# EAGLE schematic guava1_2_schematic_edit (EAGLE 7.7.0)
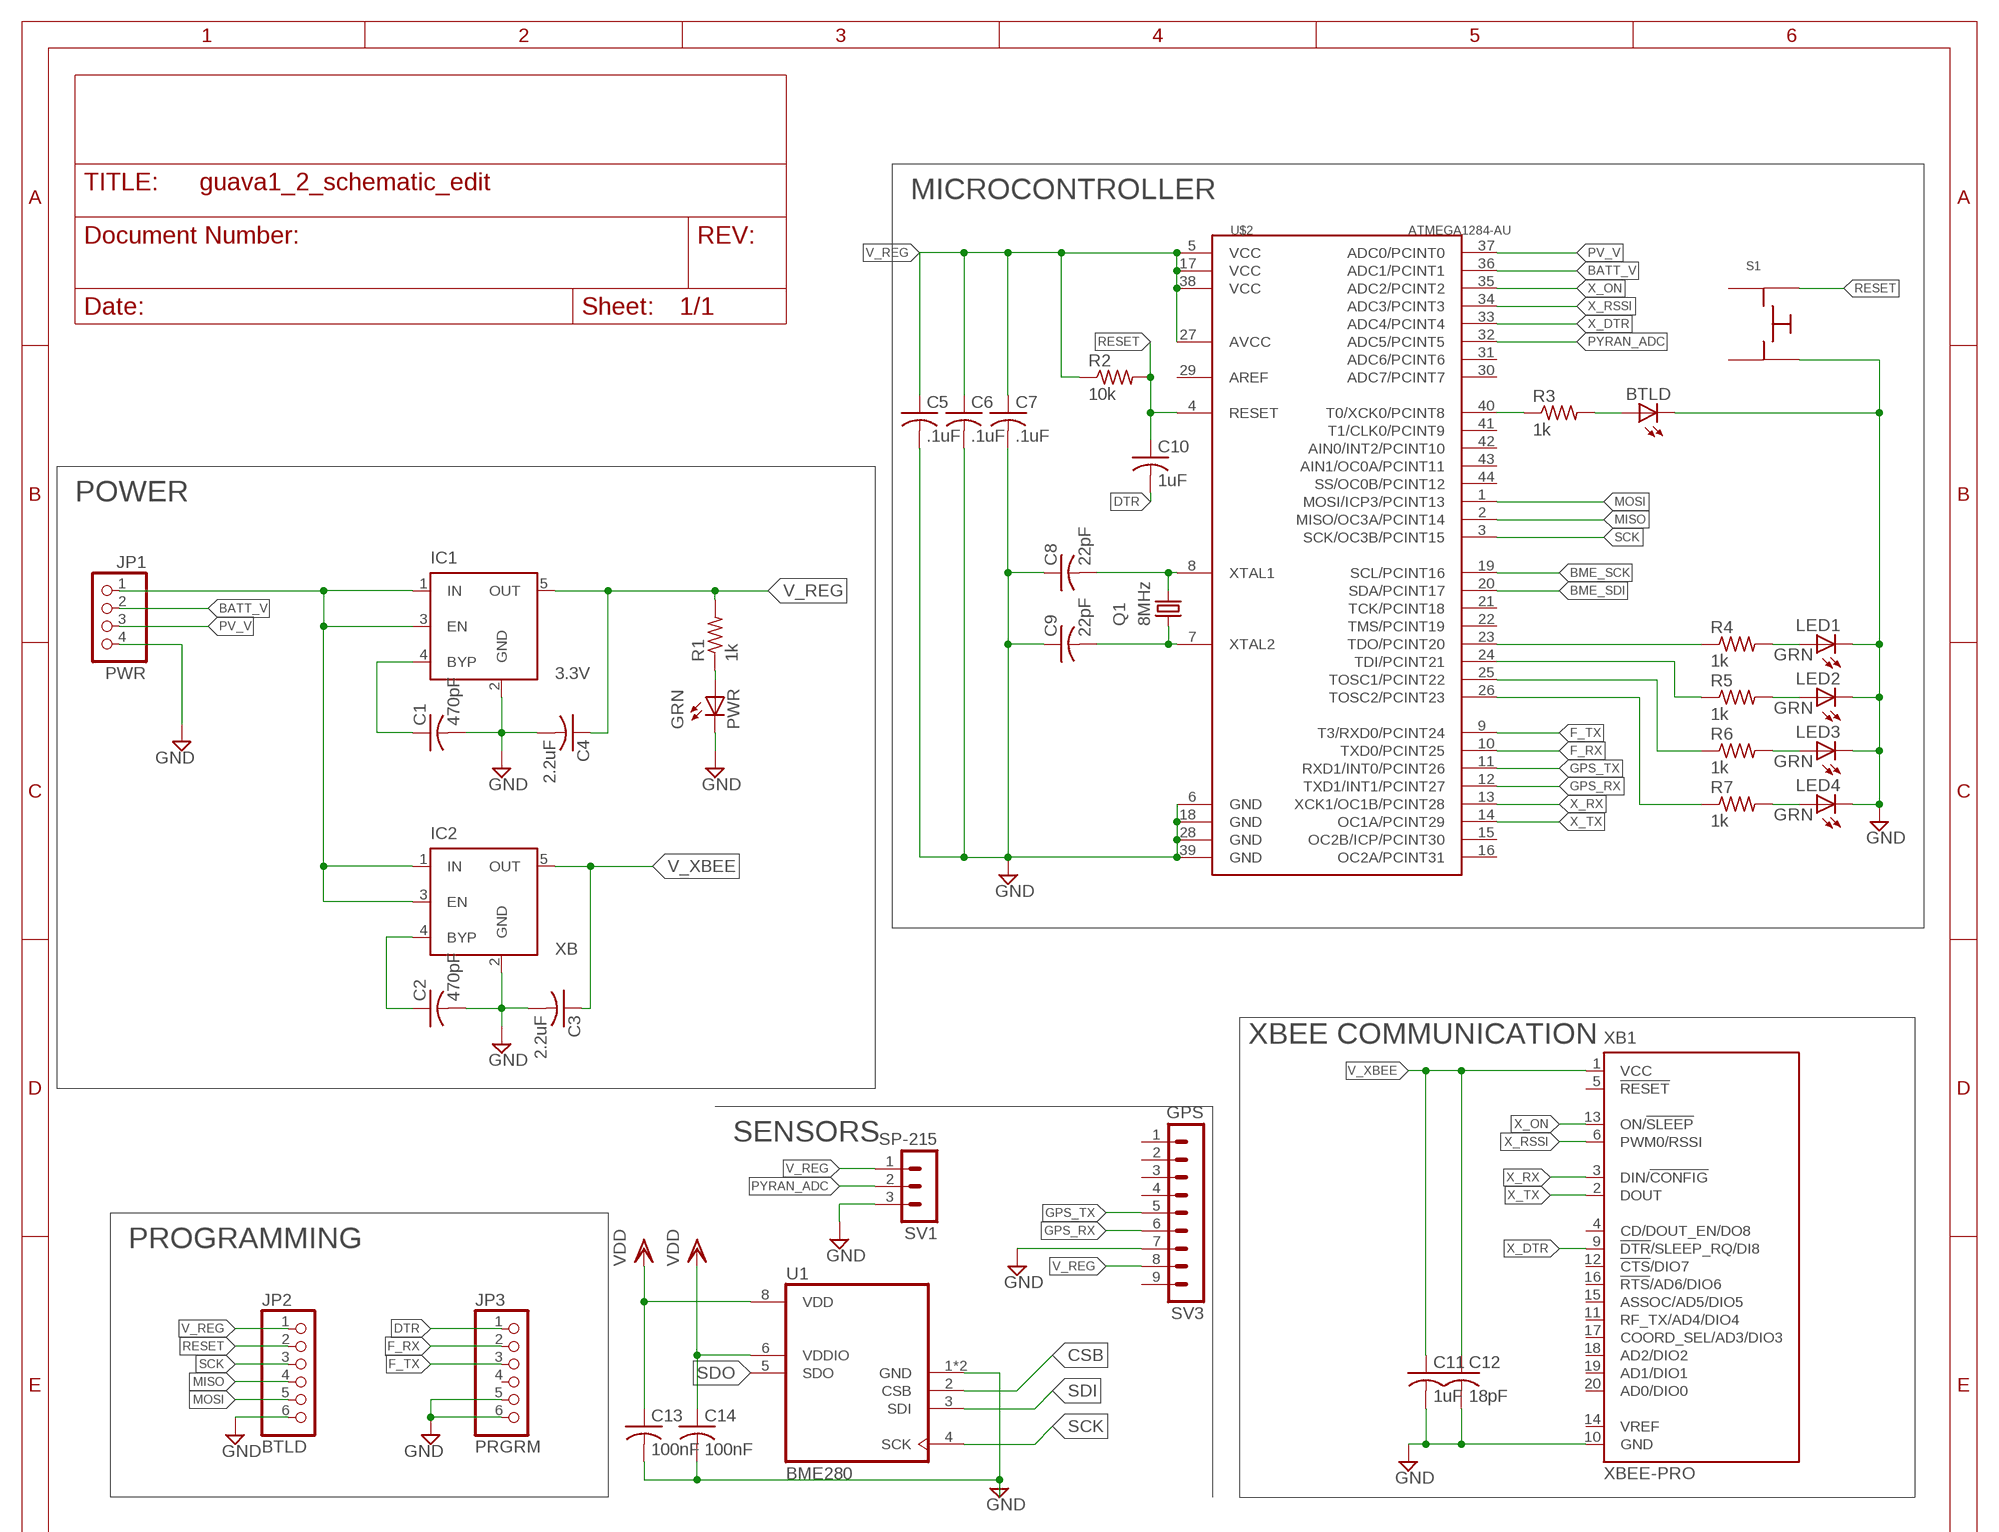
[diagram p0: schematic, sheet 1, part 1 of 2]
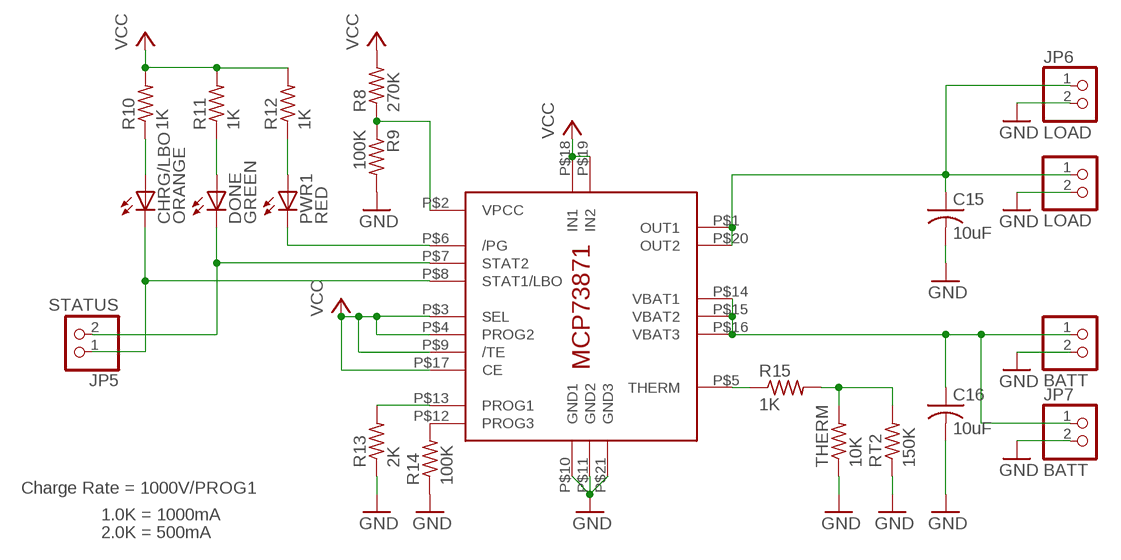
[diagram p1: schematic, sheet 1, part 2 of 2]

## Parts
BATT  JST_2PIN-SMT-RA  [JST-PH-2-SMT-RA]
BTLD  LEDCHIPLED_0805  [CHIPLED_0805]
C1  470pF  C-USC0402  [C0402]
C2  470pF  C-USC0402  [C0402]
C3  2.2uF  C-USC0603  [C0603]
C4  2.2uF  C-USC0603  [C0603]
C5  .1uF  C-USC0603  [C0603]
C6  .1uF  C-USC0603  [C0603]
C7  .1uF  C-USC0603  [C0603]
C8  22pF  C-USC0402  [C0402]
C9  22pF  C-USC0402  [C0402]
C10  1uF  C-USC0805  [C0805]
C11  1uF  C-USC0805  [C0805]
C12  18pF  C-USC0805  [C0805]
C13  100nF  C-US025-024X044  [C025-024X044]
C14  100nF  C-US025-024X044  [C025-024X044]
C15  10uF  C-USC0805K  [C0805K]
C16  10uF  C-USC0805K  [C0805K]
CHRG/LBO  ORANGE  LEDCHIP-LED0805  [CHIP-LED0805]
DONE  GREEN  LEDCHIP-LED0805  [CHIP-LED0805]
IC1  3.3V  MIC5219XX  [SOT23-5]
IC2  XB  MIC5219XX  [SOT23-5]
IC3  MCP73871  [QFN20_4MM]
JP1  PWR  PINHD-1X4  [1X04]
JP2  BTLD  PINHD-1X6  [1X06]
JP3  PRGRM  PINHD-1X6  [1X06]
JP5  STATUS  HEADER-1X2  [1X02_OVAL]
JP6  LOAD  HEADER-1X2  [1X02_OVAL]
JP7  BATT  HEADER-1X2  [1X02_OVAL]
LED1  GRN  LEDCHIPLED_0805  [CHIPLED_0805]
LED2  GRN  LEDCHIPLED_0805  [CHIPLED_0805]
LED3  GRN  LEDCHIPLED_0805  [CHIPLED_0805]
LED4  GRN  LEDCHIPLED_0805  [CHIPLED_0805]
LOAD  JST_2PIN-SMT-RA  [JST-PH-2-SMT-RA]
PWR  GRN  LEDCHIPLED_0805  [CHIPLED_0805]
PWR1  RED  LEDCHIP-LED0805  [CHIP-LED0805]
Q1  8MHz  CRYSTALHC49UP  [HC49UP]
R1  1k  R-US_R0603  [R0603]
R2  10k  R-US_R0603  [R0603]
R3  1k  R-US_R0603  [R0603]
R4  1k  R-US_R0603  [R0603]
R5  1k  R-US_R0603  [R0603]
R6  1k  R-US_R0603  [R0603]
R7  1k  R-US_R0603  [R0603]
R8  270K  R-US_R0805  [R0805]
R9  100K  R-US_R0805  [R0805]
R10  1K  R-US_R0805  [R0805]
R11  1K  R-US_R0805  [R0805]
R12  1K  R-US_R0805  [R0805]
R13  2K  R-US_FLIPFLOP  [0805-THM]
R14  100K  R-US_R0805  [R0805]
R15  1K  R-US_M0805  [M0805]
RT2  150K  R-US_M0805  [M0805]
S1  PUSH_BUTTON_SPSTSMD  [COM-12993]
SV1  SP-215  MA03-1  [MA03-1]
SV3  GPS  MA09-1  [MA09-1]
THERM  10K  R-US_FLIPFLOP  [0805-THM]
U1  BME280  [PSON65P250X250X100-8N]
U$2  ATMEGA1284-AU  [44A]
XB1  XBEE-PRO  [XBEE-PRO]

## Nets
BATT: BATT.1 C16.1 IC3.P$14(VBAT1) IC3.P$15(VBAT2) IC3.P$16(VBAT3) JP7.1
BATT_V: JP1.2 U$2.36(ADC1/PCINT1)
BME_SCK: U$2.19(SCL/PCINT16)
BME_SDI: U$2.20(SDA/PCINT17)
CSB: C13.2 C14.2 U1.1(GND) U1.2(CSB) U1.7(GND) ; supply symbol labelled GND
DTR: C10.2 JP3.1
F_RX: JP3.2 U$2.10(TXD0/PCINT25)
F_TX: JP3.3 U$2.9(T3/RXD0/PCINT24)
GND: BATT.2 BTLD.C C1.2 C2.2 C3.2 C4.2 C5.2 C6.2 C7.2 C8.1 C9.1 C11.2 C12.2 C15.2 C16.2 IC1.2(GND) IC2.2(GND) IC3.P$10(GND1) IC3.P$11(GND2) IC3.P$21(GND3) JP1.4 JP2.6 JP3.5 JP3.6 JP6.2 JP7.2 LED1.C LED2.C LED3.C LED4.C LOAD.2 PWR.C R9.2 R13.1 R14.1 RT2.1 S1.3 SV1.3 SV3.7 THERM.1 U$2.6(GND) U$2.18(GND) U$2.28(GND) U$2.39(GND) XB1.10(GND)
GPS_RX: SV3.6 U$2.12(TXD1/INT1/PCINT27)
GPS_TX: SV3.5 U$2.11(RXD1/INT0/PCINT26)
LED1: R4.1 U$2.23(TDO/PCINT20)
LED2: R5.1 U$2.24(TDI/PCINT21)
LED3: R6.1 U$2.25(TOSC1/PCINT22)
LED4: R7.1 U$2.26(TOSC2/PCINT23)
MISO: JP2.4 U$2.2(MISO/OC3A/PCINT14)
MOSI: JP2.5 U$2.1(MOSI/ICP3/PCINT13)
N$1: C8.2 Q1.2 U$2.8(XTAL1)
N$2: C9.2 Q1.1 U$2.7(XTAL2)
N$3: BTLD.A R3.2
N$4: R3.1 U$2.40(T0/XCK0/PCINT8)
N$5: IC3.P$2(VPCC) R8.1 R9.1
N$6: C1.1 IC1.4(BYP)
N$7: PWR.A R1.1
N$8: LED4.A R7.2
N$9: LED2.A R5.2
N$10: LED3.A R6.2
N$11: LED1.A R4.2
N$12: IC3.P$6(/PG) PWR1.C
N$13: DONE.C IC3.P$7(STAT2) JP5.2
N$14: C2.1 IC2.4(BYP)
N$15: CHRG/LBO.C IC3.P$8(STAT1/LBO) JP5.1
N$16: CHRG/LBO.A R10.1
N$17: DONE.A R11.1
N$18: PWR1.A R12.1
N$19: IC3.P$12(PROG3) R14.2
N$20: IC3.P$13(PROG1) R13.2
N$21: C15.1 IC3.P$1(OUT1) IC3.P$20(OUT2) JP6.1 LOAD.1
N$22: IC3.P$5(THERM) R15.1
N$23: R15.2 RT2.2 THERM.2
PV_V: JP1.3 U$2.37(ADC0/PCINT0)
PYRAN_ADC: SV1.2 U$2.32(ADC5/PCINT5)
RESET: C10.1 JP2.2 R2.2 S1.2 U$2.4(RESET)
SCK: JP2.3 U1.4(SCK) U$2.3(SCK/OC3B/PCINT15)
SDI: U1.3(SDI)
SDO: C14.1 U1.6(VDDIO) ; supply symbol labelled VDD
V_LOAD: IC1.1(IN) IC1.3(EN) IC2.1(IN) IC2.3(EN) JP1.1
V_REG: C4.1 C5.1 C6.1 C7.1 IC1.5(OUT) JP2.1 R1.2 R2.1 SV1.1 SV3.8 U$2.5(VCC) U$2.17(VCC) U$2.27(AVCC) U$2.38(VCC)
V_XBEE: C3.1 C11.1 C12.1 IC2.5(OUT) XB1.1(VCC)
VCC: IC3.P$3(SEL) IC3.P$4(PROG2) IC3.P$9(/TE) IC3.P$17(CE) IC3.P$18(IN1) IC3.P$19(IN2) R8.2 R10.2 R11.2 R12.2
VDD: C13.1 U1.8(VDD)
X_DTR: U$2.33(ADC4/PCINT4) XB1.9(!DTR!/SLEEP_RQ/DI8)
X_ON: U$2.35(ADC2/PCINT2) XB1.13(ON/!SLEEP)
X_RSSI: U$2.34(ADC3/PCINT3) XB1.6(PWM0/RSSI)
X_RX: U$2.13(XCK1/OC1B/PCINT28) XB1.3(DIN/!CONFIG)
X_TX: U$2.14(OC1A/PCINT29) XB1.2(DOUT)
Unconnected: JP3.4 S1.1 S1.4 SV3.1 SV3.2 SV3.3 SV3.4 SV3.9 U1.5(SDO) U$2.15(OC2B/ICP/PCINT30) U$2.16(OC2A/PCINT31) U$2.21(TCK/PCINT18) U$2.22(TMS/PCINT19) U$2.29(AREF) U$2.30(ADC7/PCINT7) U$2.31(ADC6/PCINT6) U$2.41(T1/CLK0/PCINT9) U$2.42(AIN0/INT2/PCINT10) U$2.43(AIN1/OC0A/PCINT11) U$2.44(SS/OC0B/PCINT12) XB1.4(CD/DOUT_EN/DO8) XB1.5(!RESET) XB1.11(RF_TX/AD4/DIO4) XB1.12(!CTS!/DIO7) XB1.14(VREF) XB1.15(ASSOC/AD5/DIO5) XB1.16(!RTS!/AD6/DIO6) XB1.17(COORD_SEL/AD3/DIO3) XB1.18(AD2/DIO2) XB1.19(AD1/DIO1) XB1.20(AD0/DIO0)

## Notes on the sheet
- MICROCONTROLLER
- POWER
- XBEE COMMUNICATION
- SENSORS | Charge Rate = 1000V/PROG1
- 1.0K = 1000mA
- 2.0K = 500mA
- PROGRAMMING

## Library data of the parts
BATT LOAD = adafruit:JST_2PIN: JST 2-Pin Connectors of various flavors SMT-RA (S2B-PH-SM4) 4UConnector #17311 SMT (B2B-PH-SM4) THM-RA (S2B-PH) THM (B2B-PH)
BTLD CHRG/LBO DONE LED1-LED4 PWR PWR1 = adafruit:LED: LED OSRAM: - CHIPLED LG R971, LG N971, LY N971, LG Q971, LY Q971, LO R971, LY R971 LH N974, LH R974 LS Q976, LO Q976, LY Q976 LO Q996 - Hyper CHIPLED LW Q18S LB Q993, LB Q99A, LB R99A - SideLED LS A670, LO A670, LY A670, LG A670, LP A670 LB A673, LV A673, LT A673, LW A673 LH A674 LY A675 LS A676, LA A676, LO A676, LY A676, LW A676 LS A679, LY A679, LG A679 - Hyper Micro SIDELED® LS Y876, LA Y876, LO Y876, LY Y876 LT Y87S - SmartLED LW L88C, LW L88S LB L89C, LB L89S, LG L890 LS L89K, LO L89K, LY L89K LS L896, LA L896, LO L896, LY L896 - TOPLED LS T670, LO T670, LY T670, LG T670, LP T670 LSG T670, LSP T670, LSY T670, LOP T670, LYG T670 LG T671, LOG T671, LSG T671 LB T673, LV T673, LT T673, LW T673 LH T674 LS T676, LA T676, LO T676, LY T676, LB T676, LH T676, LSB T676, LW T676 LB T67C, LV T67C, LT T67C, LS T67K, LO T67K, LY T67K, LW E67C LS E67B, LA E67B, LO E67B, LY E67B, LB E67C, LV E67C, LT E67C LW T67C LS T679, LY T679, LG T679 LS T770, LO T770, LY T770, LG T770, LP T770 LB T773, LV T773, LT T773, LW T773 LH T774 LS E675, LA E675, LY E675, LS T675 LS T776, LA T776, LO T776, LY T776, LB T776 LHGB T686 LT T68C, LB T68C - Hyper Mini TOPLED® LB M676 - Mini TOPLED Santana® LG M470 LS M47K, LO M47K, LY M47K Source: http://www.osram.convergy.de/
C1-C16 = adafruit:C-US: CAPACITOR, American symbol
IC1 IC2 = v-reg-micrel:MIC5219XX: VOLTAGE REGULATOR; OC_FARNELL: unknown; OC_NEWARK: unknown
IC3 = adafruit:MCP73871
JP1 = pinhead:PINHD-1X4: PIN HEADER
JP2 = pinhead:PINHD-1X6: PIN HEADER
JP3 = adafruit:PINHD-1X6: PIN HEADER
JP5-JP7 = microbuilder:HEADER-1X2: PIN HEADER
Q1 = adafruit:CRYSTAL: CRYSTAL; OC_FARNELL: unknown; OC_NEWARK: unknown
R1-R15 RT2 THERM = adafruit:R-US_: RESISTOR, American symbol
S1 = SCEL-SWITCHES:PUSH_BUTTON_SPST: COM-12993 - SMD 12mm square SPST button. This button is great for user input or a good reset button on a PCB. Specifications: Distributor: Sparkfun Distributor PN: COM-12993 <https://www.sparkfun.com/products/12993> Max Rating: 50mA @ 12V Supporting Materials COM-12993 Datasheet <https://cdn.sparkfun.com/datasheets/Components/Switches/N301102.pdf>
SV1 = con-lstb:MA03-1: PIN HEADER; OC_FARNELL: unknown; OC_NEWARK: unknown
SV3 = con-lstb:MA09-1: PIN HEADER; OC_FARNELL: unknown; OC_NEWARK: unknown
U1 = BME280:BME280: DIGITAL HUMIDITY, PRESSURE AND TEMPERATURE SENSOR * Digital interface I²C (up to 3.4 MHz) and SPI (3 and 4 wire, up to 10 MHz)* Supply voltage VDD main supply voltage range: 1.71 V to 3.6 V*VDDIO interface voltage range: 1.2 V to 3.6 V Operating range -40…+85 °C, 0…100 % rel. humidity, 300…1100 hPa The library has been designed by Richard Magdycz <https://www.facebook.com/groups/eaglecadsoftUK>; DESCRIPTION: Integrated pressure, humidity and temperature sensor; 8-pin 2.5x2.5x0.93mm LGA; MF: Bosch; MP: BME280; PACKAGE: LGA-8 Bosch
U$2 = atmega1284:ATMEGA1284-AU
XB1 = maxstream:XBEE: XBee (TM) /XBee-PRO(TM) OEM RF Modules Source: MaxStream, Inc. xbee_productmanual.pdf; MPN: XBP24-AWI-001; OC_FARNELL: 1337916; OC_NEWARK: 42M2667